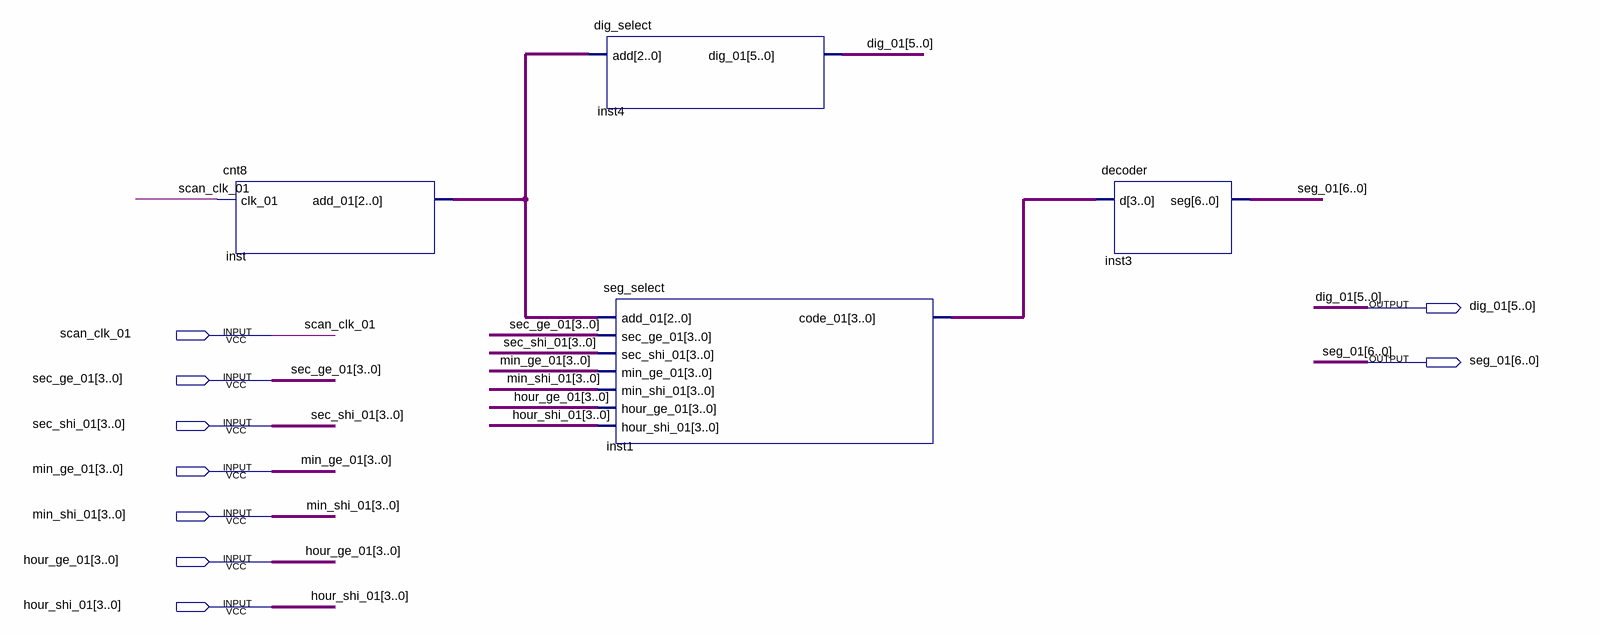
[diagram p0: schematic sheet]
// Quartus schematic display.bdf as structural Verilog: 4 symbols, 9 pins
module display (
  input  scan_clk_01,
  input  [3:0] sec_ge_01,
  input  [3:0] sec_shi_01,
  input  [3:0] min_ge_01,
  input  [3:0] min_shi_01,
  input  [3:0] hour_ge_01,
  input  [3:0] hour_shi_01,
  output [5:0] dig_01,
  output [6:0] seg_01
);

  wire [2:0] inst_add_01;
  wire [3:0] inst1_code_01;

  cnt8 inst (.clk_01(scan_clk_01), .add_01(inst_add_01));
  dig_select inst4 (.add(inst_add_01), .dig_01(dig_01));
  seg_select inst1 (
    .add_01(inst_add_01), .sec_ge_01(sec_ge_01), .sec_shi_01(sec_shi_01), .min_ge_01(min_ge_01),
    .min_shi_01(min_shi_01), .hour_ge_01(hour_ge_01), .hour_shi_01(hour_shi_01), .code_01(inst1_code_01));
  decoder inst3 (.d(inst1_code_01), .seg(seg_01));
endmodule
